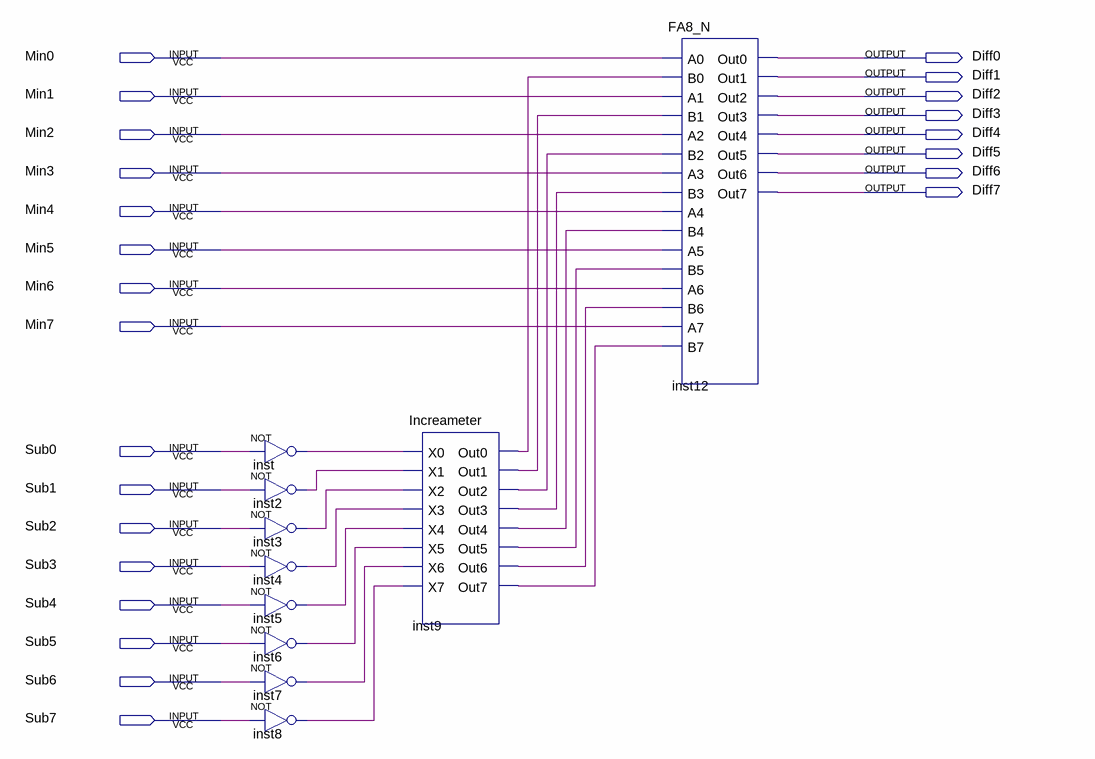
[diagram p0: schematic sheet]
// Quartus schematic Subtractor8.bdf as structural Verilog: 10 symbols, 24 pins
module Subtractor8 (
  input  Min0,
  input  Min1,
  input  Min2,
  input  Min3,
  input  Min4,
  input  Min5,
  input  Min6,
  input  Min7,
  input  Sub0,
  input  Sub1,
  input  Sub2,
  input  Sub3,
  input  Sub4,
  input  Sub5,
  input  Sub6,
  input  Sub7,
  output Diff0,
  output Diff1,
  output Diff2,
  output Diff3,
  output Diff4,
  output Diff5,
  output Diff6,
  output Diff7
);

  wire inst2_out, inst3_out, inst4_out, inst5_out, inst6_out, inst7_out, inst8_out, inst9_out0, inst9_out1,
       inst9_out2, inst9_out3, inst9_out4, inst9_out5, inst9_out6, inst9_out7, inst_out;

  not inst (inst_out, Sub0);
  not inst2 (inst2_out, Sub1);
  not inst3 (inst3_out, Sub2);
  not inst4 (inst4_out, Sub3);
  not inst5 (inst5_out, Sub4);
  not inst6 (inst6_out, Sub5);
  not inst7 (inst7_out, Sub6);
  not inst8 (inst8_out, Sub7);
  Increameter inst9 (
    .X0(inst_out), .X1(inst2_out), .X2(inst3_out), .X3(inst4_out), .X4(inst5_out), .X5(inst6_out),
    .X6(inst7_out), .X7(inst8_out), .Out0(inst9_out0), .Out1(inst9_out1), .Out2(inst9_out2),
    .Out3(inst9_out3), .Out4(inst9_out4), .Out5(inst9_out5), .Out6(inst9_out6), .Out7(inst9_out7));
  FA8_N inst12 (
    .A0(Min0), .B0(inst9_out0), .A1(Min1), .B1(inst9_out1), .A2(Min2), .B2(inst9_out2), .A3(Min3),
    .B3(inst9_out3), .A4(Min4), .B4(inst9_out4), .A5(Min5), .B5(inst9_out5), .A6(Min6), .B6(inst9_out6),
    .A7(Min7), .B7(inst9_out7), .Out0(Diff0), .Out1(Diff1), .Out2(Diff2), .Out3(Diff3), .Out4(Diff4),
    .Out5(Diff5), .Out6(Diff6), .Out7(Diff7));
endmodule
